# Altium schematic sheet Power.SchDoc
size A4
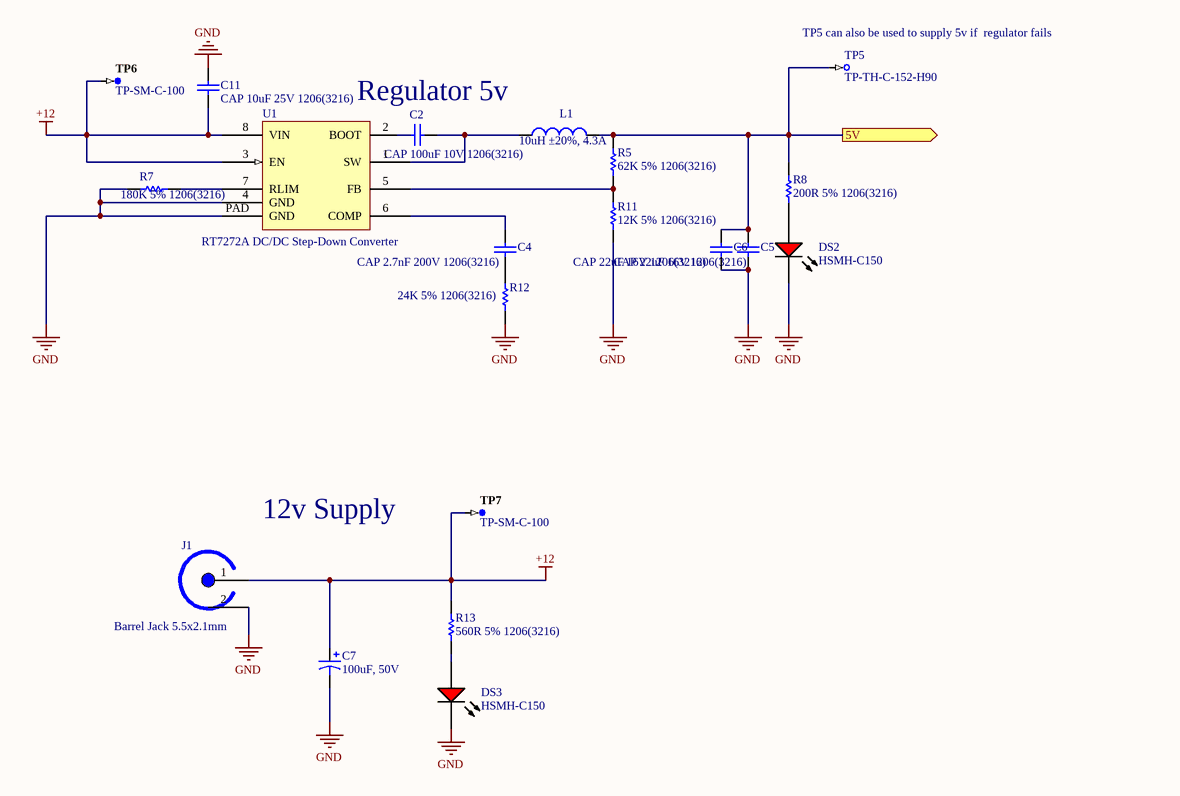
[diagram p0: Power.SchDoc]

## Parts
C2  CAP 100uF 10V 1206(3216)  [CAPC1206(3216)190_L]
C4  CAP 2.7nF 200V 1206(3216)  [CAPC1206(3216)100_L]
C5  CAP 22uF 16V 1206(3216)  [CAPC1206(3216)190_N]
C6  CAP 22uF 16V 1206(3216)  [CAPC1206(3216)190_N]
C7  100uF, 50V  [Capacitor radial 8mm]
C11  CAP 10uF 25V 1206(3216)  [CAPC1206(3216)190_N]
DS2  HSMH-C150  [AVAG-HSMX-C150_V]
DS3  HSMH-C150  [AVAG-HSMX-C150_V]
J1  Barrel Jack 5.5x2.1mm  [Barrel Jack 2.1x5.5mm THT]
L1  10uH ±20%, 4.3A  [Inductor SMD VLF10045 series]
R5  62K 5% 1206(3216)  [RESC1206(3216)_M]
R7  180K 5% 1206(3216)  [RESC1206(3216)_N]
R8  200R 5% 1206(3216)  [RESC1206(3216)_L]
R11  12K 5% 1206(3216)  [RESC1206(3216)_N]
R12  24K 5% 1206(3216)  [RESC1206(3216)_M]
R13  560R 5% 1206(3216)  [RESC1206(3216)_L]
TP5  TP-TH-C-152-H90  [TP-TH-C-152-H90]  (no BOM)
TP6  TP-SM-C-100  [TP-SM-C-100]  (no BOM)
TP7  TP-SM-C-100  [TP-SM-C-100]  (no BOM)
U1  RT7272A DC/DC Step-Down Converter  [RT7272A]

## Ports
5V (out)

## Nets
+12: C7.1 C11.1 J1.1(TIP) R13.1 TP6.1 TP7.1 U1.3(EN) U1.8(VIN)
GND: C5.2 C6.2 C7.2 C11.2 DS2.2(K) DS3.2(K) J1.2(SLEEVE) R7.2 R11.1 R12.1 U1.4(GND) U1.PAD(GND)
5V: C5.1 C6.1 L1.2 R5.2 R8.2 TP5.1 ; port 5V
NetC2_1: C2.1 U1.2(BOOT)
NetC2_2: C2.2 L1.1 U1.1(SW)
NetC4_1: C4.1 R12.2
NetC4_2: C4.2 U1.6(COMP)
NetDS2_1: DS2.1(A) R8.1
NetDS3_1: DS3.1(A) R13.2
NetR5_1: R5.1 R11.2 U1.5(FB)
NetR7_1: R7.1 U1.7(RLIM)

## Notes on the sheet
- (near TP5) TP5 can also be used to supply 5v if  regulator fails
- Regulator 5v
- 12v Supply
- CC2511 Assignment2 Group 3
- Date:
- Sheet
- of
- Time:
- Revision:
- Kim Bender, Peng Cheng
- Levi Smith, Fuzhen Liu
- Drawn by:
- File:

## Library data of the parts
C2 = CMP-1037-05006-1: CAP 100uF 10V ±20% 1206 (3216 Metric) Thickness 1.9mm SMD; Case-EIA: 1206; Tolerance: Â±20%; Case-Metric: 3216; Max Thickness: 1.9 mm; Technology: SMT; Rated Voltage: 10 V; Value: 100uF
C4 = CMP-1037-02898-1: CAP 2.7nF 200V ±5% 1206 (3216 Metric) Thickness 1mm SMD; Case-Metric: 3216; Case-EIA: 1206; Tolerance: Â±5%; Rated Voltage: 200 V; Technology: SMT; Max Thickness: 1 mm; Value: 2.7nF
C5 C6 = CMP-1037-04992-1: CAP 22uF 16V ±10% 1206 (3216 Metric) Thickness 1.9mm SMD; Case-EIA: 1206; Case-Metric: 3216; Tolerance: Â±10%; Rated Voltage: 16 V; Technology: SMT; Value: 22uF; Max Thickness: 1.9 mm
C7 = Cap 100uF, 50V, THT radial: Electrolytic Capacitor, 100 µF, 50 V, ± 20%, Radial Leaded, 8 mm
C11 = CMP-1037-04980-1: CAP 10uF 25V ±20% 1206 (3216 Metric) Thickness 1.9mm SMD; Case-EIA: 1206; Case-Metric: 3216; Tolerance: Â±20%; Value: 10uF; Rated Voltage: 25 V; Technology: SMT; Max Thickness: 1.9 mm
DS2 DS3 = CMP-2000-06426-1: LED Uni-Color Red, 65 mW, 25 mA, -40 to 85 degC, 2-Pin SMD, RoHS, Tape and Reel; Manufacturer: Avago; Product Height (mm): 1.1mm; Power Dissipation: 78W; Product Length (mm): 3.2mm; Forward Voltage: 2.6V; Luminous Intensity: 17mcd; DELETED: Compliant; Shape Type: Rectangular; Peak Wavelength: 660nm; Main Category: ChipLED; Dominant Wave Length: 639nm; Rad Hardened: No; Lens Type: ColorlessDiffused; Product Depth (mm): 1.6mm; Reverse Voltage: 5V; Forward Current: 25mA; Chip Material: GaAlAs; Test Current (It): 20mA; Viewing Angle: 170deg; Number of  Elements: 1; Type: Uni-Color; Package Reference: HSMX-C150; Package Description: 2-Pin Surface Mount Device, Body 3.2 x 1.6 mm; Operating Temp Range: -40Cto85C; Mounting: SurfaceMount; Emitting Color: Red; Pin Count: 2; Operating Temperature Classification: Industrial; Datasheet URL: http://media.digikey.com/pdf/Data%20Sheets/Avago%20PDFs/HSMz-Czzz.pdf; Package Type: ChipLed; Mounting Technology: SurfaceMount; High Brightness: No; Lens Dimensions: 2x1.6x0.6mm; Manufacturer URL: http://www.avagotech.com/; Lum Intensity: 17mcd; Datasheet Version: 03/2012; Packaging: TapeandReel
J1 = Barrel Jack 5.5x2.1mm: GCT DCJ200-10-A-K1-K
L1 = Inductor SMD VLF10045T-100M4R3 10uH: Inductor SMD - 10uH, 4.3A, ±20%; Value: 10uH
R5 = CMP-1014-00117-1: 62K 0.25W 5% 1206 (3216 Metric)  SMD; Case-Metric: 3216; Value: 62000.00 Ohm; Case-EIA: 1206; Technology: SMT; Tolerance: 5 %; Power: 0.25 W
R7 = CMP-1014-00128-1: 180K 0.25W 5% 1206 (3216 Metric)  SMD; Case-EIA: 1206; Value: 180000.00 Ohm; Case-Metric: 3216; Power: 0.25 W; Tolerance: 5 %; Technology: SMT
R8 = CMP-1014-00057-1: 200R 0.25W 5% 1206 (3216 Metric)  SMD; Case-EIA: 1206; Value: 200.00 Ohm; Case-Metric: 3216; Tolerance: 5 %; Technology: SMT; Power: 0.25 W
R11 = CMP-1014-00100-1: 12K 0.25W 5% 1206 (3216 Metric)  SMD; Value: 12000.00 Ohm; Case-EIA: 1206; Case-Metric: 3216; Power: 0.25 W; Tolerance: 5 %; Technology: SMT
R12 = CMP-1014-00107-1: 24K 0.25W 5% 1206 (3216 Metric)  SMD; Value: 24000.00 Ohm; Case-EIA: 1206; Case-Metric: 3216; Technology: SMT; Power: 0.25 W; Tolerance: 5 %
R13 = CMP-1014-00068-1: 560R 0.25W 5% 1206 (3216 Metric)  SMD; Case-Metric: 3216; Case-EIA: 1206; Value: 560.00 Ohm; Tolerance: 5 %; Power: 0.25 W; Technology: SMT
TP5 = CMP-0484-00003-2: Test Point, Through Hole, Hole Size 0.9 mm, PCB Mount with Silkscreen Box; Manufacturer: No Vendor; PartNumber: TP-TH-C-152-H90
TP6 TP7 = CMP-0484-00002-2: Test Point, Surface Mount, Circular, Pad Diameter 1 mm; Manufacturer: No Vendor; PartNumber: TP-SM-C-100
U1 = RT7272A DC/DC Step-Down Converter: RIchtek RT7272A 3A, 36V, 500kHz Synchronous Step-Down Converter